# EAGLE schematic esp8266-UdpTemp (EAGLE 7.2.0)
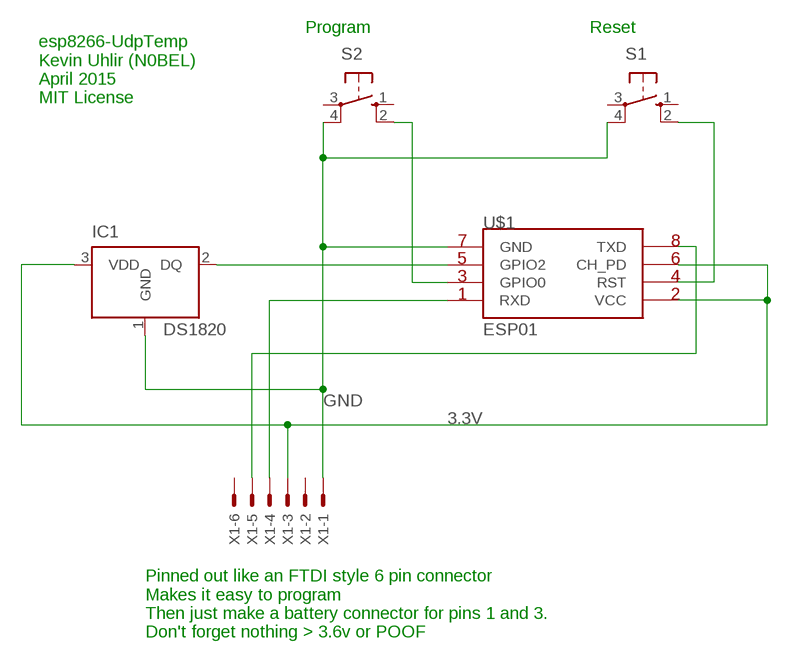
[diagram p0: schematic, sheet 1]

## Parts
IC1  DS1820  [TO-92]
S1  10-XX  [B3F-10XX]
S2  10-XX  [B3F-10XX]
U$1  ESP01  [ESP01]
X1  22-23-2061  [22-23-2061]

## Nets
3.3V: IC1.3(VDD) U$1.CH_PD U$1.VCC X1.3
GND: IC1.1(GND) S1.4(P1) S2.4(P1) U$1.GND X1.1
N$1: IC1.2(DQ) U$1.GPIO2
N$3: S2.2(S1) U$1.GPIO0
N$5: S1.2(S1) U$1.RST
RX: U$1.TX(TXD) X1.5
TX: U$1.RX(RXD) X1.4
Unconnected: S1.1(S) S1.3(P) S2.1(S) S2.3(P) X1.2 X1.6

## Notes on the sheet
- Program | Reset
- esp8266-UdpTemp
  Kevin Uhlir (N0BEL)
  April 2015
  MIT License
- Pinned out like an FTDI style 6 pin connector
  Makes it easy to program
  Then just make a battery connector for pins 1 and 3.
  Don't forget nothing > 3.6v or POOF

## Library data of the parts
IC1 = DS1820:DS1820: DS1820 - 1-Wire Digital Thermometer
S1 S2 = switch-omron:10-XX: OMRON SWITCH; MPN: B3F-1000; OC_FARNELL: 176432; OC_NEWARK: 36M3542
U$1 = esp8266modules:ESP01: ESP8266 Wifi module 01
X1 = con-molex:22-23-2061: .100" (2.54mm) Center Header - 6 Pin; MF: MOLEX; MPN: 22-23-2061; OC_FARNELL: 1462922; OC_NEWARK: 27C1933